# EAGLE design right (EAGLE 9.1.3)
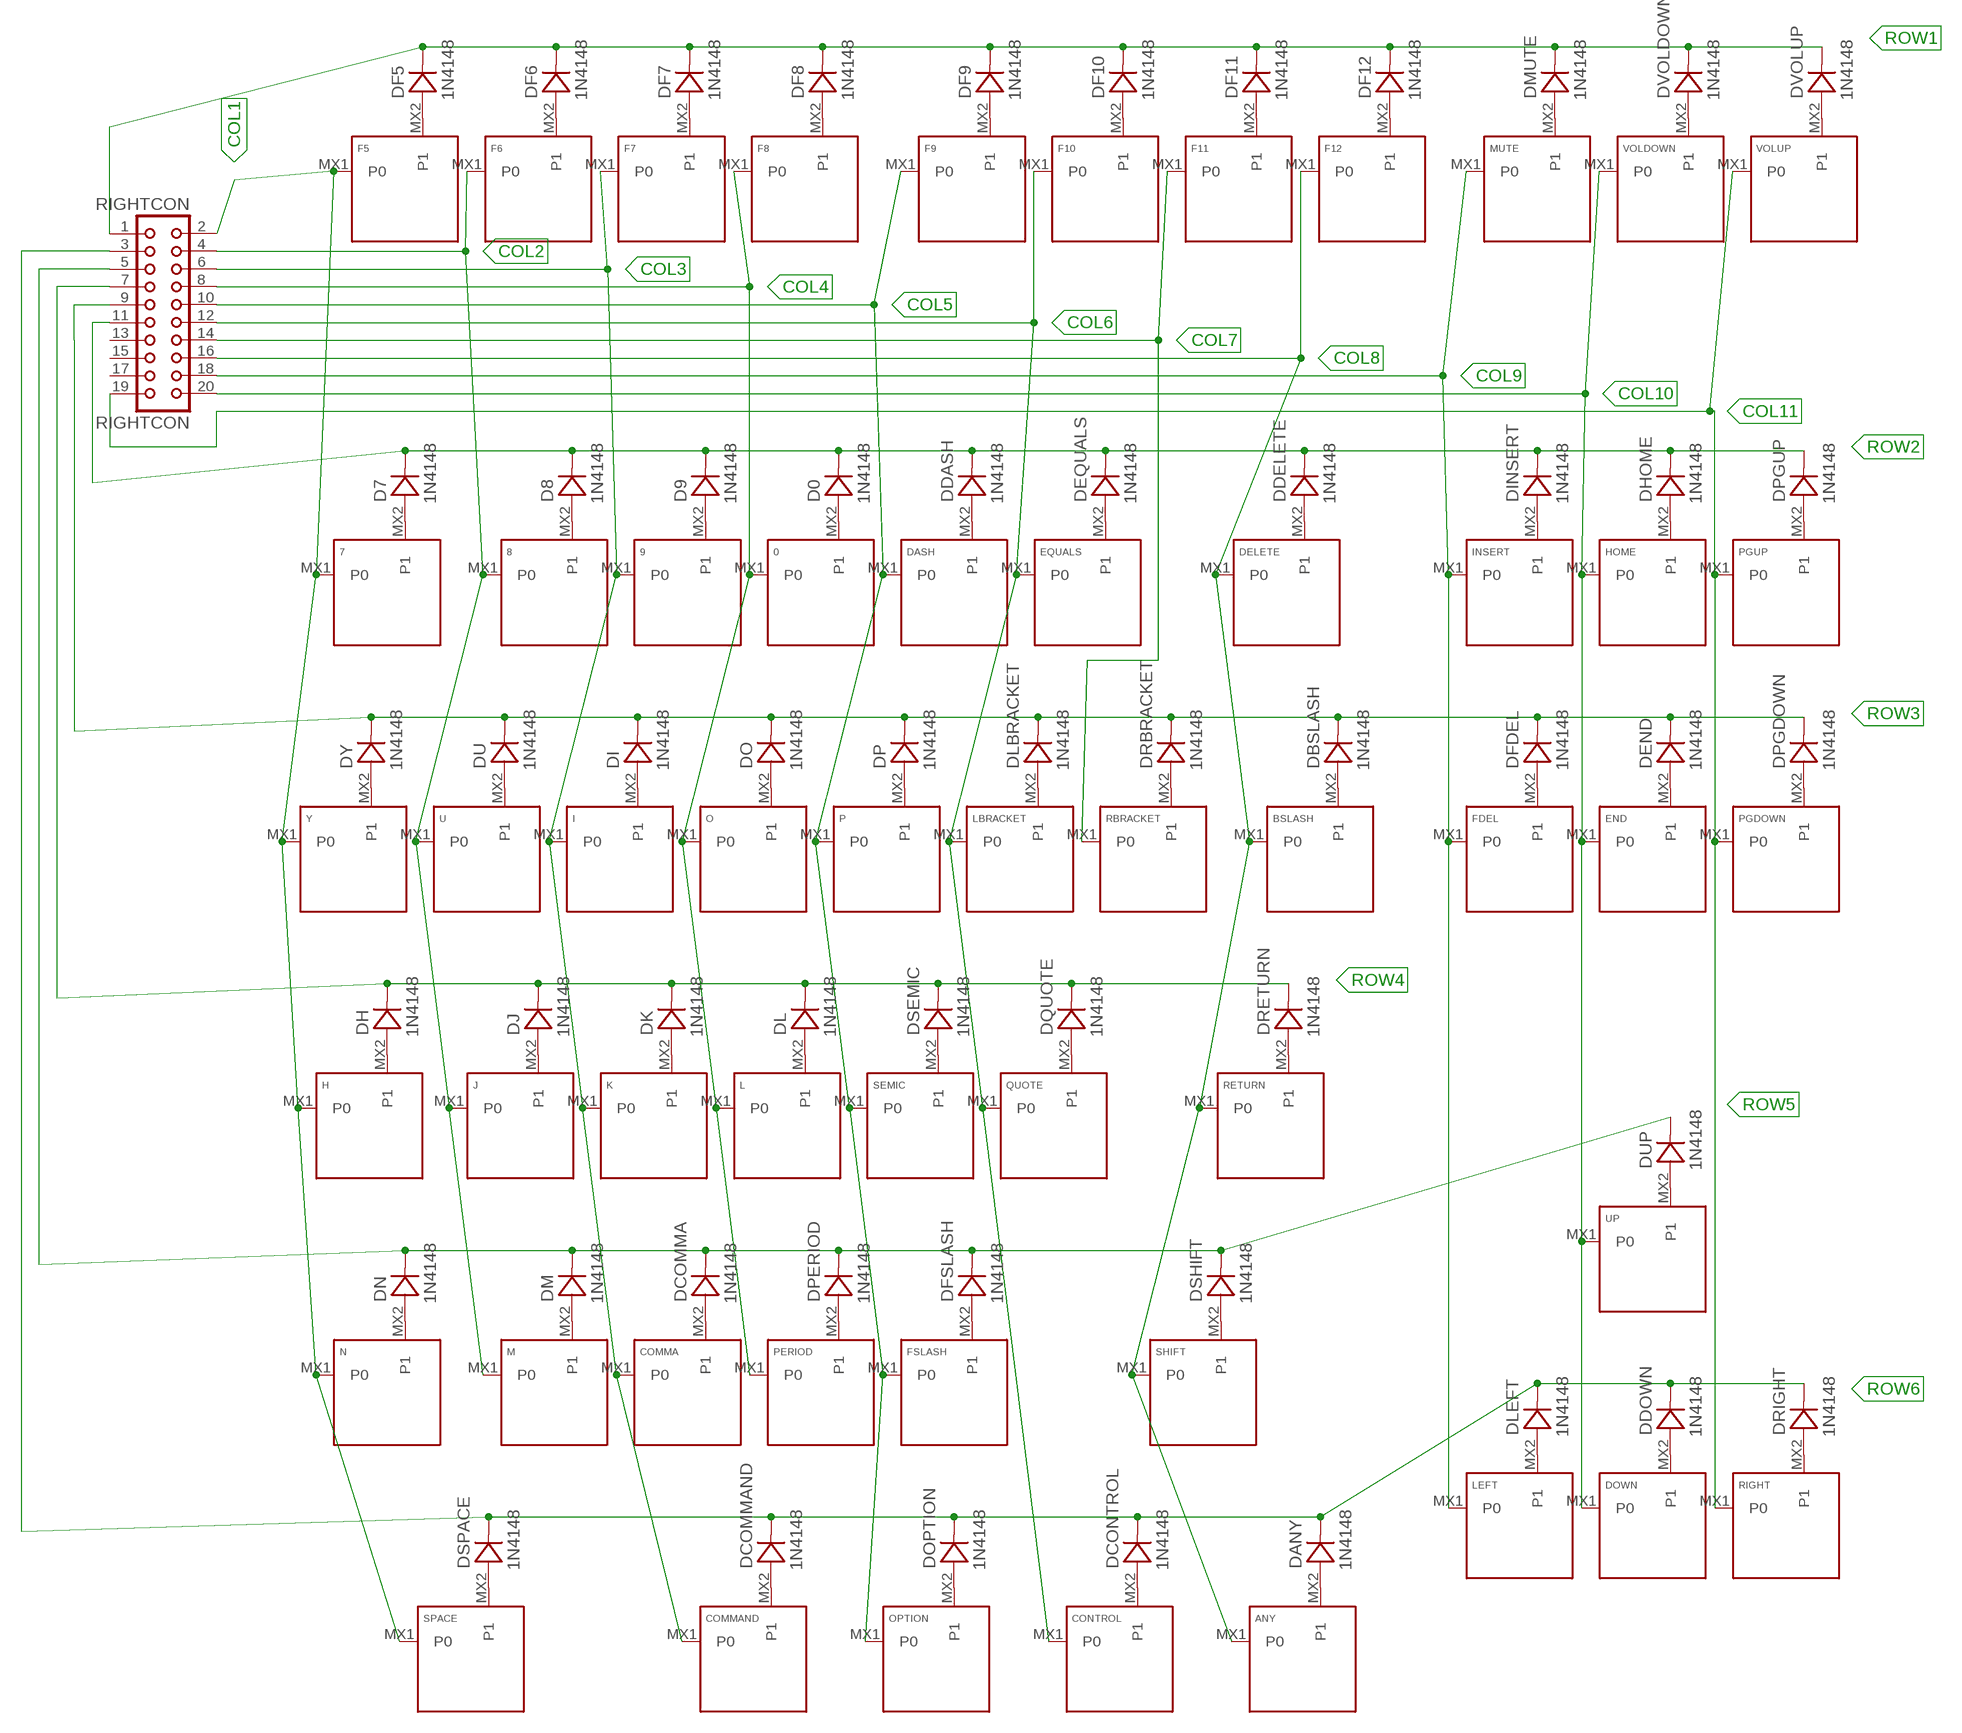
[diagram p0: schematic, sheet 1]

## Parts
0  KEYSWITCH-PLAIN-MX-1U  [MX-1U]
7  KEYSWITCH-PLAIN-MX-1U  [MX-1U]
8  KEYSWITCH-PLAIN-MX-1U  [MX-1U]
9  KEYSWITCH-PLAIN-MX-1U  [MX-1U]
ANY  KEYSWITCH-PLAIN-MX-1U  [MX-1U]
BSLASH  KEYSWITCH-PLAIN-MX-1U  [MX-1U]
COMMA  KEYSWITCH-PLAIN-MX-1U  [MX-1U]
COMMAND  KEYSWITCH-PLAIN-MX-1U  [MX-1U]
CONTROL  KEYSWITCH-PLAIN-MX-1U  [MX-1U]
D0  1N4148  DIODE-DO-35  [DO-35]
D7  1N4148  DIODE-DO-35  [DO-35]
D8  1N4148  DIODE-DO-35  [DO-35]
D9  1N4148  DIODE-DO-35  [DO-35]
DANY  1N4148  DIODE-DO-35  [DO-35]
DASH  KEYSWITCH-PLAIN-MX-1U  [MX-1U]
DBSLASH  1N4148  DIODE-DO-35  [DO-35]
DCOMMA  1N4148  DIODE-DO-35  [DO-35]
DCOMMAND  1N4148  DIODE-DO-35  [DO-35]
DCONTROL  1N4148  DIODE-DO-35  [DO-35]
DDASH  1N4148  DIODE-DO-35  [DO-35]
DDELETE  1N4148  DIODE-DO-35  [DO-35]
DDOWN  1N4148  DIODE-DO-35  [DO-35]
DELETE  KEYSWITCH-PLAIN-MX-2U  [MX-2U]
DEND  1N4148  DIODE-DO-35  [DO-35]
DEQUALS  1N4148  DIODE-DO-35  [DO-35]
DF5  1N4148  DIODE-DO-35  [DO-35]
DF6  1N4148  DIODE-DO-35  [DO-35]
DF7  1N4148  DIODE-DO-35  [DO-35]
DF8  1N4148  DIODE-DO-35  [DO-35]
DF9  1N4148  DIODE-DO-35  [DO-35]
DF10  1N4148  DIODE-DO-35  [DO-35]
DF11  1N4148  DIODE-DO-35  [DO-35]
DF12  1N4148  DIODE-DO-35  [DO-35]
DFDEL  1N4148  DIODE-DO-35  [DO-35]
DFSLASH  1N4148  DIODE-DO-35  [DO-35]
DH  1N4148  DIODE-DO-35  [DO-35]
DHOME  1N4148  DIODE-DO-35  [DO-35]
DI  1N4148  DIODE-DO-35  [DO-35]
DINSERT  1N4148  DIODE-DO-35  [DO-35]
DJ  1N4148  DIODE-DO-35  [DO-35]
DK  1N4148  DIODE-DO-35  [DO-35]
DL  1N4148  DIODE-DO-35  [DO-35]
DLBRACKET  1N4148  DIODE-DO-35  [DO-35]
DLEFT  1N4148  DIODE-DO-35  [DO-35]
DM  1N4148  DIODE-DO-35  [DO-35]
DMUTE  1N4148  DIODE-DO-35  [DO-35]
DN  1N4148  DIODE-DO-35  [DO-35]
DO  1N4148  DIODE-DO-35  [DO-35]
DOPTION  1N4148  DIODE-DO-35  [DO-35]
DOWN  KEYSWITCH-PLAIN-MX-1U  [MX-1U]
DP  1N4148  DIODE-DO-35  [DO-35]
DPERIOD  1N4148  DIODE-DO-35  [DO-35]
DPGDOWN  1N4148  DIODE-DO-35  [DO-35]
DPGUP  1N4148  DIODE-DO-35  [DO-35]
DQUOTE  1N4148  DIODE-DO-35  [DO-35]
DRBRACKET  1N4148  DIODE-DO-35  [DO-35]
DRETURN  1N4148  DIODE-DO-35  [DO-35]
DRIGHT  1N4148  DIODE-DO-35  [DO-35]
DSEMIC  1N4148  DIODE-DO-35  [DO-35]
DSHIFT  1N4148  DIODE-DO-35  [DO-35]
DSPACE  1N4148  DIODE-DO-35  [DO-35]
DU  1N4148  DIODE-DO-35  [DO-35]
DUP  1N4148  DIODE-DO-35  [DO-35]
DVOLDOWN  1N4148  DIODE-DO-35  [DO-35]
DVOLUP  1N4148  DIODE-DO-35  [DO-35]
DY  1N4148  DIODE-DO-35  [DO-35]
END  KEYSWITCH-PLAIN-MX-1U  [MX-1U]
EQUALS  KEYSWITCH-PLAIN-MX-1U  [MX-1U]
F5  KEYSWITCH-PLAIN-MX-1U  [MX-1U]
F6  KEYSWITCH-PLAIN-MX-1U  [MX-1U]
F7  KEYSWITCH-PLAIN-MX-1U  [MX-1U]
F8  KEYSWITCH-PLAIN-MX-1U  [MX-1U]
F9  KEYSWITCH-PLAIN-MX-1U  [MX-1U]
F10  KEYSWITCH-PLAIN-MX-1U  [MX-1U]
F11  KEYSWITCH-PLAIN-MX-1U  [MX-1U]
F12  KEYSWITCH-PLAIN-MX-1U  [MX-1U]
FDEL  KEYSWITCH-PLAIN-MX-1U  [MX-1U]
FSLASH  KEYSWITCH-PLAIN-MX-1U  [MX-1U]
H  KEYSWITCH-PLAIN-MX-1U  [MX-1U]
HOME  KEYSWITCH-PLAIN-MX-1U  [MX-1U]
I  KEYSWITCH-PLAIN-MX-1U  [MX-1U]
INSERT  KEYSWITCH-PLAIN-MX-1U  [MX-1U]
J  KEYSWITCH-PLAIN-MX-1U  [MX-1U]
K  KEYSWITCH-PLAIN-MX-1U  [MX-1U]
L  KEYSWITCH-PLAIN-MX-1U  [MX-1U]
LBRACKET  KEYSWITCH-PLAIN-MX-1U  [MX-1U]
LEFT  KEYSWITCH-PLAIN-MX-1U  [MX-1U]
M  KEYSWITCH-PLAIN-MX-1U  [MX-1U]
MUTE  KEYSWITCH-PLAIN-MX-1U  [MX-1U]
N  KEYSWITCH-PLAIN-MX-1U  [MX-1U]
O  KEYSWITCH-PLAIN-MX-1U  [MX-1U]
OPTION  KEYSWITCH-PLAIN-MX-1U  [MX-1U]
P  KEYSWITCH-PLAIN-MX-1U  [MX-1U]
PERIOD  KEYSWITCH-PLAIN-MX-1U  [MX-1U]
PGDOWN  KEYSWITCH-PLAIN-MX-1U  [MX-1U]
PGUP  KEYSWITCH-PLAIN-MX-1U  [MX-1U]
QUOTE  KEYSWITCH-PLAIN-MX-1U  [MX-1U]
RBRACKET  KEYSWITCH-PLAIN-MX-1U  [MX-1U]
RETURN  KEYSWITCH-PLAIN-MX-2U  [MX-2U]
RIGHT  KEYSWITCH-PLAIN-MX-1U  [MX-1U]
RIGHTCON  RIGHTCON  CON20  [CON20]
SEMIC  KEYSWITCH-PLAIN-MX-1U  [MX-1U]
SHIFT  KEYSWITCH-PLAIN-MX-2U  [MX-2U]
SPACE  KEYSWITCH-PLAIN-MX-2U  [MX-2U]
U  KEYSWITCH-PLAIN-MX-1U  [MX-1U]
UP  KEYSWITCH-PLAIN-MX-1U  [MX-1U]
VOLDOWN  KEYSWITCH-PLAIN-MX-1U  [MX-1U]
VOLUP  KEYSWITCH-PLAIN-MX-1U  [MX-1U]
Y  KEYSWITCH-PLAIN-MX-1U  [MX-1U]

## Nets
COL1: 7.MX1(P0) F5.MX1(P0) H.MX1(P0) N.MX1(P0) RIGHTCON.2 SPACE.MX1(P0) Y.MX1(P0)
COL2: 8.MX1(P0) F6.MX1(P0) J.MX1(P0) M.MX1(P0) RIGHTCON.4 U.MX1(P0)
COL3: 9.MX1(P0) COMMA.MX1(P0) COMMAND.MX1(P0) F7.MX1(P0) I.MX1(P0) K.MX1(P0) RIGHTCON.6
COL4: 0.MX1(P0) F8.MX1(P0) L.MX1(P0) O.MX1(P0) PERIOD.MX1(P0) RIGHTCON.8
COL5: DASH.MX1(P0) F9.MX1(P0) FSLASH.MX1(P0) OPTION.MX1(P0) P.MX1(P0) RIGHTCON.10 SEMIC.MX1(P0)
COL6: CONTROL.MX1(P0) EQUALS.MX1(P0) F10.MX1(P0) LBRACKET.MX1(P0) QUOTE.MX1(P0) RIGHTCON.12
COL7: F11.MX1(P0) RBRACKET.MX1(P0) RIGHTCON.14
COL8: ANY.MX1(P0) BSLASH.MX1(P0) DELETE.MX1(P0) F12.MX1(P0) RETURN.MX1(P0) RIGHTCON.16 SHIFT.MX1(P0)
COL9: FDEL.MX1(P0) INSERT.MX1(P0) LEFT.MX1(P0) MUTE.MX1(P0) RIGHTCON.18
COL10: DOWN.MX1(P0) END.MX1(P0) HOME.MX1(P0) RIGHTCON.20 UP.MX1(P0) VOLDOWN.MX1(P0)
COL11: PGDOWN.MX1(P0) PGUP.MX1(P0) RIGHT.MX1(P0) RIGHTCON.19 VOLUP.MX1(P0)
N$1: DF5.A F5.MX2(P1)
N$2: DF6.A F6.MX2(P1)
N$3: DF7.A F7.MX2(P1)
N$4: DF8.A F8.MX2(P1)
N$5: DF9.A F9.MX2(P1)
N$6: DF10.A F10.MX2(P1)
N$7: DF11.A F11.MX2(P1)
N$8: DF12.A F12.MX2(P1)
N$9: DMUTE.A MUTE.MX2(P1)
N$10: DVOLDOWN.A VOLDOWN.MX2(P1)
N$11: DVOLUP.A VOLUP.MX2(P1)
N$12: 7.MX2(P1) D7.A
N$13: 8.MX2(P1) D8.A
N$14: 9.MX2(P1) D9.A
N$15: 0.MX2(P1) D0.A
N$16: DASH.MX2(P1) DDASH.A
N$17: DEQUALS.A EQUALS.MX2(P1)
N$18: DDELETE.A DELETE.MX2(P1)
N$19: DINSERT.A INSERT.MX2(P1)
N$20: DHOME.A HOME.MX2(P1)
N$21: DPGUP.A PGUP.MX2(P1)
N$22: DY.A Y.MX2(P1)
N$23: DU.A U.MX2(P1)
N$24: DI.A I.MX2(P1)
N$25: DO.A O.MX2(P1)
N$26: DP.A P.MX2(P1)
N$27: DLBRACKET.A LBRACKET.MX2(P1)
N$28: DRBRACKET.A RBRACKET.MX2(P1)
N$29: BSLASH.MX2(P1) DBSLASH.A
N$30: DFDEL.A FDEL.MX2(P1)
N$31: DEND.A END.MX2(P1)
N$32: DPGDOWN.A PGDOWN.MX2(P1)
N$33: DH.A H.MX2(P1)
N$34: DJ.A J.MX2(P1)
N$35: DK.A K.MX2(P1)
N$36: DL.A L.MX2(P1)
N$37: DSEMIC.A SEMIC.MX2(P1)
N$38: DQUOTE.A QUOTE.MX2(P1)
N$39: DRETURN.A RETURN.MX2(P1)
N$40: DN.A N.MX2(P1)
N$41: DM.A M.MX2(P1)
N$42: COMMA.MX2(P1) DCOMMA.A
N$43: DPERIOD.A PERIOD.MX2(P1)
N$44: DFSLASH.A FSLASH.MX2(P1)
N$45: DSHIFT.A SHIFT.MX2(P1)
N$46: DSPACE.A SPACE.MX2(P1)
N$47: COMMAND.MX2(P1) DCOMMAND.A
N$48: DOPTION.A OPTION.MX2(P1)
N$49: CONTROL.MX2(P1) DCONTROL.A
N$50: ANY.MX2(P1) DANY.A
N$51: DLEFT.A LEFT.MX2(P1)
N$52: DDOWN.A DOWN.MX2(P1)
N$53: DRIGHT.A RIGHT.MX2(P1)
N$54: DUP.A UP.MX2(P1)
ROW1: DF5.C DF6.C DF7.C DF8.C DF9.C DF10.C DF11.C DF12.C DMUTE.C DVOLDOWN.C DVOLUP.C RIGHTCON.1
ROW2: D0.C D7.C D8.C D9.C DDASH.C DDELETE.C DEQUALS.C DHOME.C DINSERT.C DPGUP.C RIGHTCON.11
ROW3: DBSLASH.C DEND.C DFDEL.C DI.C DLBRACKET.C DO.C DP.C DPGDOWN.C DRBRACKET.C DU.C DY.C RIGHTCON.9
ROW4: DH.C DJ.C DK.C DL.C DQUOTE.C DRETURN.C DSEMIC.C RIGHTCON.7
ROW5: DCOMMA.C DFSLASH.C DM.C DN.C DPERIOD.C DSHIFT.C DUP.C RIGHTCON.5
ROW6: DANY.C DCOMMAND.C DCONTROL.C DDOWN.C DLEFT.C DOPTION.C DRIGHT.C DSPACE.C RIGHTCON.3
Unconnected: RIGHTCON.13 RIGHTCON.15 RIGHTCON.17

## Library data of the parts
0 7-9 ANY BSLASH COMMA COMMAND CONTROL DASH DELETE DOWN END EQUALS F5-F12 FDEL FSLASH H HOME I INSERT J K L LBRACKET LEFT M MUTE N O OPTION P PERIOD PGDOWN PGUP QUOTE RBRACKET RETURN RIGHT SEMIC SHIFT SPACE U UP VOLDOWN VOLUP Y = Keyboard:KEYSWITCH-PLAIN
D0 D7-D9 DANY DBSLASH DCOMMA DCOMMAND DCONTROL DDASH DDELETE DDOWN DEND DEQUALS DF5-DF12 DFDEL DFSLASH DH DHOME DI DINSERT DJ DK DL DLBRACKET DLEFT DM DMUTE DN DO DOPTION DP DPERIOD DPGDOWN DPGUP DQUOTE DRBRACKET DRETURN DRIGHT DSEMIC DSHIFT DSPACE DU DUP DVOLDOWN DVOLUP DY = Controller:DIODE: Standard 1N4148 diode
RIGHTCON = con-harting:CON20: CONNECTOR; OC_FARNELL: unknown; OC_NEWARK: unknown

## Board
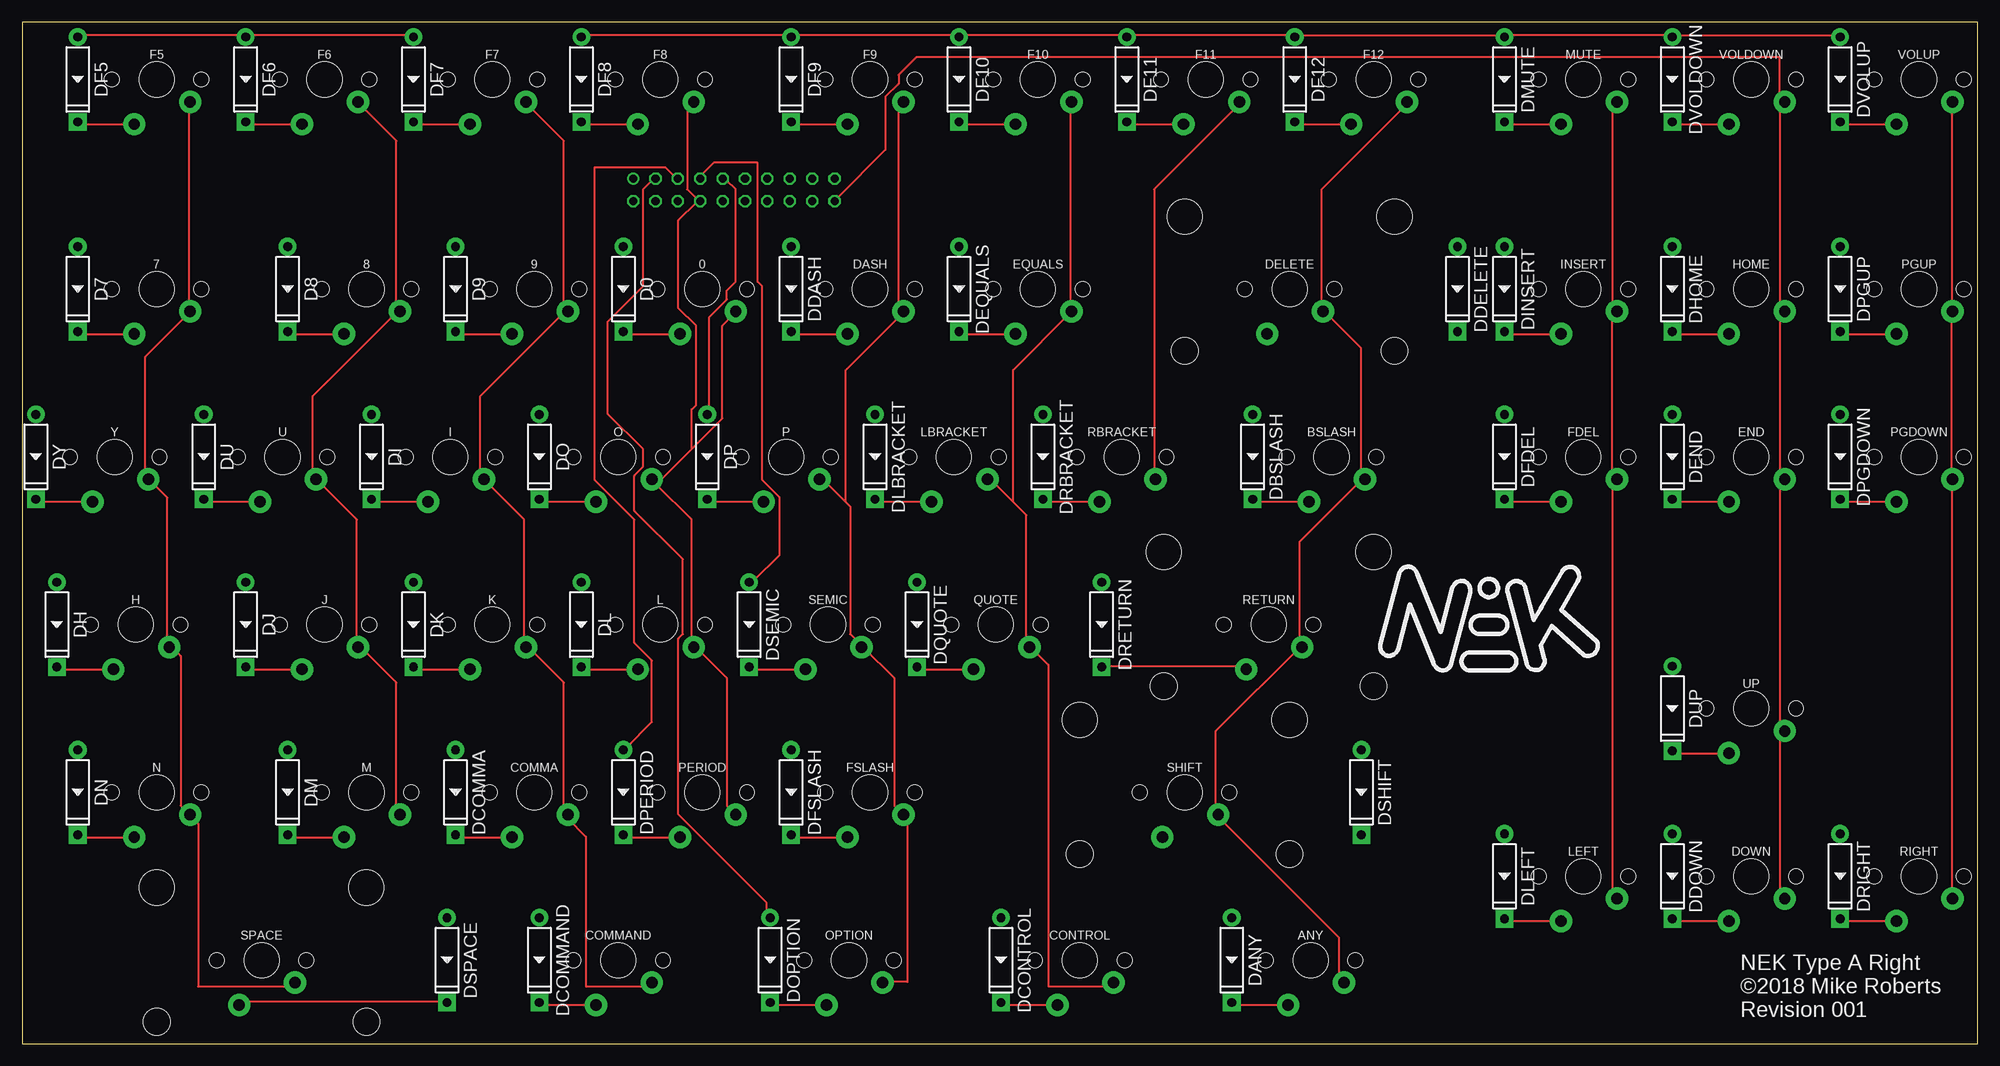
[diagram p1: board, top side]
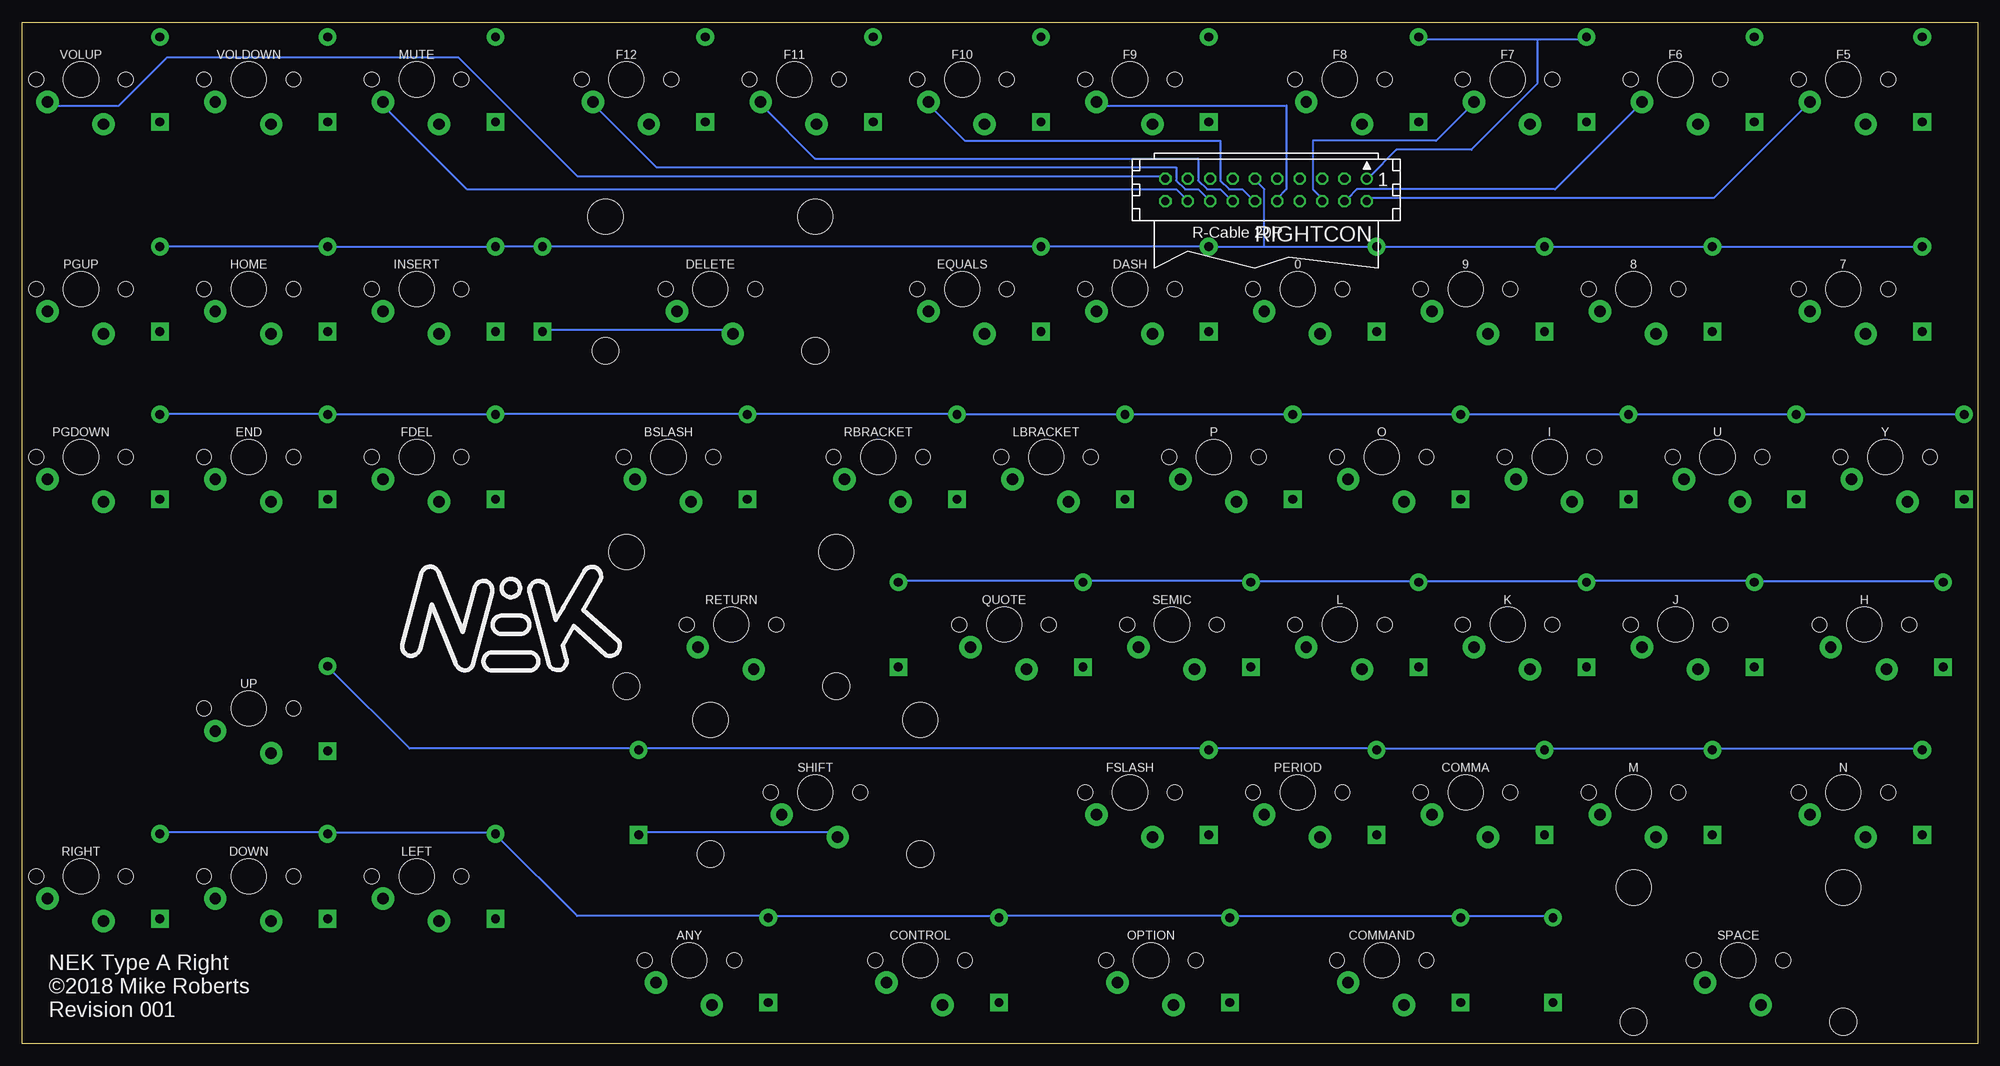
[diagram p2: board, bottom side, seen from below]

Size 222 x 116 mm. Coordinates in mm from the lower left corner, seen from the top.
Outline: 0,0 222,0 222,116 0,116 0,0
Copper layers (1*16): Top 0.035559375mm / dielectric 1.6mm / Bottom 0.035559375mm
Design rules "oshpark-2layer-auto-routing": minimum track width 10mil, minimum drill 10mil, track to track 10mil, track to pad 8mil, pad to pad 8mil, via to via 8mil, smd to smd 6mil, copper to edge 15mil, drill to drill 6mil, minimum pad ring 6mil, minimum via ring 6mil, stop-mask expansion 2.5mil, vias tented up to drill 0mil, thermal gap 10mil

### Footprints (pad centres in the part's own frame; a part is rotated, then mirrored left to right if it is on the bottom)
MX-1U = drill 1.3 pad 2.54: MX1 -3.81,2.54; MX2 2.54,5.08 | hole 4: 0,0 | hole 1.7: -5.08,0; 5.08,0
DO-35 = drill 1 pad 2 square: A 4.82,0 | drill 1 pad 2: C -4.82,0
MX-2U = drill 1.3 pad 2.54: MX1 -3.81,2.54; MX2 2.54,5.08 | hole 4: 0,0; -11.9,-8.24; 11.9,-8.24 | hole 1.7: -5.08,0; 5.08,0 | hole 3.05: -11.9,7; 11.9,7
CON20 = drill 0.914: 1 -11.43,-1.27 | drill 0.914 octagon: 2 -11.43,1.27; 3 -8.89,-1.27; 4 -8.89,1.27; 5 -6.35,-1.27; 6 -6.35,1.27; 7 -3.81,-1.27; 8 -3.81,1.27; 9 -1.27,-1.27; 10 -1.27,1.27; 11 1.27,-1.27; 12 1.27,1.27; 13 3.81,-1.27; 14 3.81,1.27; 15 6.35,-1.27; 16 6.35,1.27; 17 8.89,-1.27; 18 8.89,1.27; 19 11.43,-1.27; 20 11.43,1.27

### Placement (x,y rotation side)
0  77.2,85.67 180 top
7  15.28,85.67 180 top
8  39.1,85.67 180 top
9  58.15,85.67 180 top
ANY  146.25,9.47 180 top
BSLASH  148.63,66.62 180 top
COMMA  58.15,28.52 180 top
COMMAND  67.67,9.47 180 top
CONTROL  120.06,9.47 180 top
D0  68.25,85.67 270 top
D7  6.33,85.67 270 top
D8  30.15,85.67 270 top
D9  49.2,85.67 270 top
DANY  137.3,9.47 270 top
DASH  96.25,85.67 180 top
DBSLASH  139.68,66.62 270 top
DCOMMA  49.2,28.52 270 top
DCOMMAND  58.72,9.47 270 top
DCONTROL  111.11,9.47 270 top
DDASH  87.3,85.67 270 top
DDELETE  162.92,85.67 270 top
DDOWN  187.31,18.99 270 top
DELETE  143.87,85.67 180 top
DEND  187.31,66.62 270 top
DEQUALS  106.35,85.67 270 top
DF5  6.33,109.48 270 top
DF6  25.38,109.48 270 top
DF7  44.43,109.48 270 top
DF8  63.48,109.48 270 top
DF9  87.3,109.48 270 top
DF10  106.35,109.48 270 top
DF11  125.4,109.48 270 top
DF12  144.45,109.48 270 top
DFDEL  168.26,66.62 270 top
DFSLASH  87.3,28.52 270 top
DH  3.95,47.57 270 top
DHOME  187.31,85.67 270 top
DI  39.67,66.62 270 top
DINSERT  168.26,85.67 270 top
DJ  25.38,47.57 270 top
DK  44.43,47.57 270 top
DL  63.48,47.57 270 top
DLBRACKET  96.82,66.62 270 top
DLEFT  168.26,18.99 270 top
DM  30.15,28.52 270 top
DMUTE  168.26,109.48 270 top
DN  6.33,28.52 270 top
DO  58.72,66.62 270 top
DOPTION  84.91,9.47 270 top
DOWN  196.26,18.99 180 top
DP  77.77,66.62 270 top
DPERIOD  68.25,28.52 270 top
DPGDOWN  206.36,66.62 270 top
DPGUP  206.36,85.67 270 top
DQUOTE  101.58,47.57 270 top
DRBRACKET  115.87,66.62 270 top
DRETURN  122.54,47.57 270 top
DRIGHT  206.36,18.99 270 top
DSEMIC  82.53,47.57 270 top
DSHIFT  152.01,28.52 270 top
DSPACE  48.24,9.47 270 top
DU  20.62,66.62 270 top
DUP  187.31,38.04 270 top
DVOLDOWN  187.31,109.48 270 top
DVOLUP  206.36,109.48 270 top
DY  1.57,66.62 270 top
END  196.26,66.62 180 top
EQUALS  115.3,85.67 180 top
F5  15.28,109.48 180 top
F6  34.33,109.48 180 top
F7  53.38,109.48 180 top
F8  72.43,109.48 180 top
F9  96.25,109.48 180 top
F10  115.3,109.48 180 top
F11  134.35,109.48 180 top
F12  153.4,109.48 180 top
FDEL  177.21,66.62 180 top
FSLASH  96.25,28.52 180 top
H  12.9,47.57 180 top
HOME  196.26,85.67 180 top
I  48.62,66.62 180 top
INSERT  177.21,85.67 180 top
J  34.33,47.57 180 top
K  53.38,47.57 180 top
L  72.43,47.57 180 top
LBRACKET  105.77,66.62 180 top
LEFT  177.21,18.99 180 top
M  39.1,28.52 180 top
MUTE  177.21,109.48 180 top
N  15.28,28.52 180 top
O  67.67,66.62 180 top
OPTION  93.86,9.47 180 top
P  86.72,66.62 180 top
PERIOD  77.2,28.52 180 top
PGDOWN  215.31,66.62 180 top
PGUP  215.31,85.67 180 top
QUOTE  110.53,47.57 180 top
RBRACKET  124.82,66.62 180 top
RETURN  141.49,47.57 180 top
RIGHT  215.31,18.99 180 top
RIGHTCON  80.79,96.94 180 bottom
SEMIC  91.48,47.57 180 top
SHIFT  131.96,28.52 180 top
SPACE  27.19,9.47 180 top
U  29.57,66.62 180 top
UP  196.26,38.04 180 top
VOLDOWN  196.26,109.48 180 top
VOLUP  215.31,109.48 180 top
Y  10.52,66.62 180 top

### Tracks (layer width: path | path; a pad name or v marks a point on that pad's centre or on a via)
COL1
  Top 0.254: SPACE.MX1 31,6.5 20,6.5 20,25 19.5,25.5 N.MX1 19,26 18,27 18,44 17,45 H.MX1 16.5,45.5 16.5,62 14.5,64 Y.MX1 14,64.5 14,78 19,83 7.MX1 19,83.5 19,106.5 F5.MX1
  Bottom 0.254: RIGHTCON.2 69,96 30,96 19.5,106.5 F5.MX1
COL2
  Top 0.254: M.MX1 42.5,26 42.5,41 38.5,45 J.MX1 38,45.5 38,59.5 33.5,64 U.MX1 33,64.5 33,73.5 42.5,83 8.MX1 42.5,83.5 42.5,102.5 38.5,106.5 F6.MX1
  Bottom 0.254: RIGHTCON.4 71.5,96 70.5,97 48,97 38.5,106.5 F6.MX1
COL3
  Top 0.254: COMMAND.MX1 71,6.5 64,6.5 64,23.5 62,25.5 COMMA.MX1 61.5,26 61.5,41 57.5,45 K.MX1 57,45.5 57,59.5 52.5,64 I.MX1 52,64.5 52,73.5 61.5,83 9.MX1 61.5,83.5 61.5,102.5 57.5,106.5 F7.MX1
  Bottom 0.254: RIGHTCON.6 74.5,96 75.5,97 75.5,102.5 61.5,102.5 57.5,106.5 F7.MX1
COL4
  Top 0.254: F8.MX1 76,106.5 75.5,106 75.5,97 76.5,96 RIGHTCON.8 76.5,95.5 74.5,93.5 74.5,83.5 76.5,81.5 76.5,72.5 76,72 76,67.5 | 72,63.5 76,59.5 76,45.5 L.MX1 76.5,45 80,41.5 80,27 81,26 PERIOD.MX1 | 72,63.5 71.5,64 O.MX1 72,63.5 | 72,63.5 76,67.5 | 76,67.5 79.5,71 79.5,81.5 81,83 0.MX1
COL5
  Top 0.254: OPTION.MX1 98,7 100.5,7 100.5,25.5 FSLASH.MX1 100,26 99,27 99,41.5 95.5,45 SEMIC.MX1 95,45.5 94,46.5 94,61 93.5,61.5 | 93.5,61.5 91,64 P.MX1 | 99.5,82.5 93.5,76.5 93.5,61.5 | 99.5,82.5 100,83 DASH.MX1 99.5,82.5 | 99.5,82.5 99.5,106 100,106.5 F9.MX1
  Bottom 0.254: RIGHTCON.10 79.5,96 78.5,97 78.5,106.5 100,106.5 F9.MX1
COL6
  Top 0.254: F10.MX1 119,106.5 119,83.5 EQUALS.MX1 119,83 112.5,76.5 112.5,61.5 | CONTROL.MX1 123.5,6.5 116.5,6.5 116.5,43 114.5,45 QUOTE.MX1 114,45.5 114,60 112.5,61.5 | 112.5,61.5 110,64 LBRACKET.MX1
  Bottom 0.254: RIGHTCON.12 82.5,96 83.5,97 85,97 86,98 86,102.5 115,102.5 119,106.5 F10.MX1
COL7
  Top 0.254: RBRACKET.MX1 128.5,64.5 128.5,97 138,106.5 F11.MX1
  Bottom 0.254: RIGHTCON.14 85,96 86,97 87.5,97 88.5,98 88.5,100.5 132,100.5 138,106.5 F11.MX1
COL8
  Top 0.254: ANY.MX1 150,7 149.5,7.5 149.5,12 136,25.5 SHIFT.MX1 135.5,26 135.5,35.5 145,45 RETURN.MX1 145,45.5 145,57 152,64 BSLASH.MX1 152,64.5 152,79 148,83 DELETE.MX1 147.5,83.5 147.5,97 157,106.5 F12.MX1
  Bottom 0.254: RIGHTCON.16 87.5,96 88.5,97 90,97 91,98 91,99.5 150,99.5 157,106.5 F12.MX1
COL9
  Top 0.254: 180.5,63.5 180.5,17 181,16.5 LEFT.MX1 | 180.5,63.5 181,64 FDEL.MX1 180.5,63.5 | 180.5,63.5 180.5,82.5 181,83 INSERT.MX1 181,83.5 180.5,84 180.5,106 181,106.5 MUTE.MX1
  Bottom 0.254: RIGHTCON.18 90,96 91,97 171.5,97 181,106.5 MUTE.MX1
COL10
  Top 0.254: 200,35.5 199.5,35 199.5,17 200,16.5 DOWN.MX1 | 200,35.5 UP.MX1 200,35.5 | 199.5,65 200,64.5 END.MX1 199.5,65 | 199.5,65 199.5,82.5 200,83 HOME.MX1 200,83.5 199.5,84 199.5,107.5 | 200,35.5 199.5,36 199.5,65 | 199.5,107.5 199.5,112 101.5,112 99.5,110 99.5,109 98,107.5 98,101.5 92.5,96 RIGHTCON.20 | 199.5,107.5 200,107 VOLDOWN.MX1 199.5,107.5
COL11
  Top 0.254: RIGHT.MX1 219,16.5 219,64 PGDOWN.MX1 219,64.5 219,83 PGUP.MX1 219,83.5 219,106.5 VOLUP.MX1
  Bottom 0.254: RIGHTCON.19 92.5,98.5 159,98.5 172.5,112 205.5,112 211,106.5 219,106.5 VOLUP.MX1
N$1
  Top 0.254: DF5.A 6.59,104.4 F5.MX2
N$2
  Top 0.254: DF6.A 25.64,104.4 F6.MX2
N$3
  Top 0.254: DF7.A 44.69,104.4 F7.MX2
N$4
  Top 0.254: DF8.A 63.74,104.4 F8.MX2
N$5
  Top 0.254: DF9.A 87.56,104.4 F9.MX2
N$6
  Top 0.254: DF10.A 106.61,104.4 F10.MX2
N$7
  Top 0.254: DF11.A 125.66,104.4 F11.MX2
N$8
  Top 0.254: DF12.A 144.71,104.4 F12.MX2
N$9
  Top 0.254: DMUTE.A 168.52,104.4 MUTE.MX2
N$10
  Top 0.254: DVOLDOWN.A 187.57,104.4 VOLDOWN.MX2
N$11
  Top 0.254: DVOLUP.A 206.62,104.4 VOLUP.MX2
N$12
  Top 0.254: D7.A 6.59,80.59 7.MX2
N$13
  Top 0.254: D8.A 30.41,80.59 8.MX2
N$14
  Top 0.254: D9.A 49.46,80.59 9.MX2
N$15
  Top 0.254: D0.A 68.51,80.59 0.MX2
N$16
  Top 0.254: DDASH.A 87.56,80.59 DASH.MX2
N$17
  Top 0.254: DEQUALS.A 106.61,80.59 EQUALS.MX2
N$18
  Bottom 0.254: DDELETE.A 162.5,81 141.5,81 DELETE.MX2
N$19
  Top 0.254: DINSERT.A 168.52,80.59 INSERT.MX2
N$20
  Top 0.254: DHOME.A 187.57,80.59 HOME.MX2
N$21
  Top 0.254: DPGUP.A 206.62,80.59 PGUP.MX2
N$22
  Top 0.254: DY.A 1.83,61.54 Y.MX2
N$23
  Top 0.254: DU.A 20.88,61.54 U.MX2
N$24
  Top 0.254: DI.A 39.93,61.54 I.MX2
N$25
  Top 0.254: DO.A 58.98,61.54 O.MX2
N$26
  Top 0.254: DP.A 78.03,61.54 P.MX2
N$27
  Top 0.254: DLBRACKET.A 97.08,61.54 LBRACKET.MX2
N$28
  Top 0.254: DRBRACKET.A 116.13,61.54 RBRACKET.MX2
N$29
  Top 0.254: DBSLASH.A 139.94,61.54 BSLASH.MX2
N$30
  Top 0.254: DFDEL.A 168.52,61.54 FDEL.MX2
N$31
  Top 0.254: DEND.A 187.57,61.54 END.MX2
N$32
  Top 0.254: DPGDOWN.A 206.62,61.54 PGDOWN.MX2
N$33
  Top 0.254: DH.A 4.21,42.49 H.MX2
N$34
  Top 0.254: DJ.A 25.64,42.49 J.MX2
N$35
  Top 0.254: DK.A 44.69,42.49 K.MX2
N$36
  Top 0.254: DL.A 63.74,42.49 L.MX2
N$37
  Top 0.254: DSEMIC.A 82.79,42.49 SEMIC.MX2
N$38
  Top 0.254: DQUOTE.A 101.84,42.49 QUOTE.MX2
N$39
  Top 0.254: DRETURN.A 122.8,42.49 123.17,42.86 138.58,42.86 RETURN.MX2
N$40
  Top 0.254: DN.A 6.59,23.44 N.MX2
N$41
  Top 0.254: DM.A 30.41,23.44 M.MX2
N$42
  Top 0.254: DCOMMA.A 49.46,23.44 COMMA.MX2
N$43
  Top 0.254: DPERIOD.A 68.51,23.44 PERIOD.MX2
N$44
  Top 0.254: DFSLASH.A 87.56,23.44 FSLASH.MX2
N$45
  Bottom 0.254: DSHIFT.A 152,24 130,24 129.5,23.5 SHIFT.MX2
N$46
  Top 0.254: DSPACE.A 47.98,4.39 47.61,4.76 25.02,4.76 SPACE.MX2
N$47
  Top 0.254: DCOMMAND.A 58.98,4.39 COMMAND.MX2
N$48
  Top 0.254: DOPTION.A 85.17,4.39 OPTION.MX2
N$49
  Top 0.254: DCONTROL.A 111.37,4.39 CONTROL.MX2
N$50
  Top 0.254: DANY.A 137.56,4.39 ANY.MX2
N$51
  Top 0.254: DLEFT.A 168.52,13.91 LEFT.MX2
N$52
  Top 0.254: DDOWN.A 187.57,13.91 DOWN.MX2
N$53
  Top 0.254: DRIGHT.A 206.62,13.91 RIGHT.MX2
N$54
  Top 0.254: DUP.A 187.57,32.96 UP.MX2
ROW1
  Top 0.254: DF5.C 6.5,114.5 25,114.5 DF6.C 25.5,114.5 44,114.5 DF7.C | DVOLUP.C 206,114.5 187.5,114.5 DVOLDOWN.C 187,114.5 168.5,114.5 DMUTE.C 168,114.5 144.5,114.5 DF12.C 144,114.5 125.5,114.5 DF11.C 125,114.5 106.5,114.5 DF10.C 106,114.5 87.5,114.5 DF9.C 87,114.5 63.5,114.5 DF8.C
  Bottom 0.254: 50,114 50,109 57.5,101.5 66,101.5 69,98.5 RIGHTCON.1 | 50,114 44.5,114 DF7.C | 50,114 63,114 DF8.C
ROW2
  Bottom 0.254: DPGUP.C 206,90.5 187.5,90.5 DHOME.C 187,90.5 168.5,90.5 DINSERT.C 168,90.5 163,90.5 DDELETE.C 162.5,90.5 106.5,90.5 DEQUALS.C 106,90.5 87.5,90.5 DDASH.C 87,90.5 81,90.5 | D7.C 6.5,90.5 30,90.5 D8.C 30.5,90.5 49,90.5 D9.C 49.5,90.5 68,90.5 D0.C 68.5,90.5 81,90.5 | 81,90.5 81,97 82,98 RIGHTCON.11
ROW3
  Top 0.254: RIGHTCON.9 80,98 81,97 81,86.5 80,85.5 80,84.5 78,82.5 78,71.5 DP.C
  Bottom 0.254: DY.C 2,71.5 20.5,71.5 DU.C 21,71.5 39.5,71.5 DI.C 40,71.5 58.5,71.5 DO.C 59,71.5 77.5,71.5 DP.C 78,71.5 96.5,71.5 DLBRACKET.C 97,71.5 115.5,71.5 DRBRACKET.C 116,71.5 139.5,71.5 DBSLASH.C 140,71.5 168,71.5 DFDEL.C 168.5,71.5 187,71.5 DEND.C 187.5,71.5 206,71.5 DPGDOWN.C
ROW4
  Top 0.254: RIGHTCON.7 77,98.5 78.5,100 83.5,100 83.5,86.5 84,86 84,64 86,62 86,55.5 83,52.5 DSEMIC.C
  Bottom 0.254: DH.C 4,52.5 25,52.5 DJ.C 25.5,52.5 44,52.5 DK.C 44.5,52.5 63,52.5 DL.C 63.5,52.5 82.5,52.5 DSEMIC.C 83,52.5 101.5,52.5 DQUOTE.C 102,52.5 122.5,52.5 DRETURN.C
ROW5
  Top 0.254: RIGHTCON.5 74,98.5 73,99.5 65,99.5 65,64 69.5,59.5 69.5,45.5 71.5,43.5 71.5,36.5 68.5,33.5 DPERIOD.C
  Bottom 0.254: DN.C 6.5,33.5 30,33.5 DM.C 30.5,33.5 49,33.5 DCOMMA.C 49.5,33.5 68,33.5 DPERIOD.C 68.5,33.5 87,33.5 DFSLASH.C 87.5,33.5 152,33.5 DSHIFT.C 152.5,33.5 178,33.5 187,42.5 DUP.C
ROW6
  Top 0.254: RIGHTCON.3 71.5,98 70.5,97 70.5,86 66.5,82 66.5,71.5 70.5,67.5 70.5,65.5 69.5,64.5 69.5,60.5 75,55 75,46.5 74.5,46 74.5,26 84.5,16 84.5,14.5 DOPTION.C
  Bottom 0.254: DSPACE.C 48.5,14.5 58.5,14.5 DCOMMAND.C 59,14.5 84.5,14.5 DOPTION.C 85,14.5 111,14.5 DCONTROL.C 111.5,14.5 137,14.5 DANY.C 137.5,14.5 159,14.5 168,23.5 DLEFT.C 168.5,24 187,24 DDOWN.C 187.5,24 206,24 DRIGHT.C

### Text on the board
tNames: NEK Type A Right / ©2018 Mike Roberts / Revision 001
bNames: NEK Type A Right / ©2018 Mike Roberts / Revision 001